# Altium schematic sheet USB_hub.SchDoc
size A4
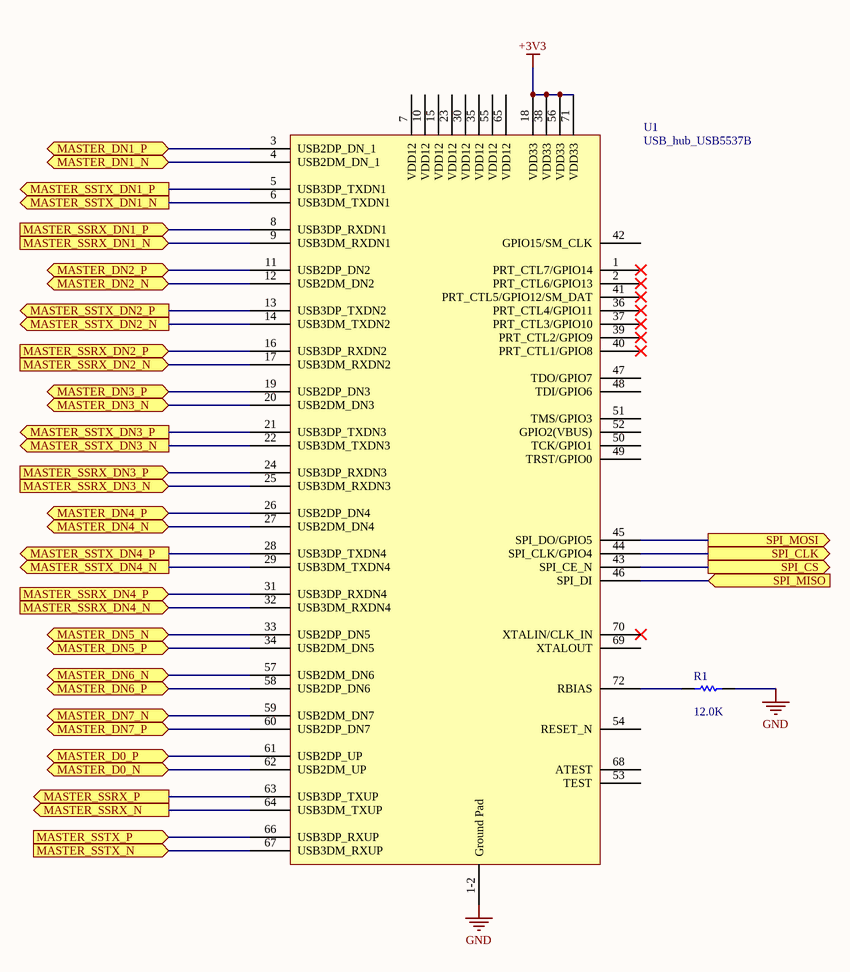
[diagram p0: USB_hub.SchDoc]

## Parts
R1  value 12.0K  [RESC6332]  (hidden comment: Res1)
U1  USB_hub_USB5537B  [QFN50P1000X1000X100_HS-73N]

## Ports
MASTER_D0_N (bidir), MASTER_D0_P (bidir), MASTER_DN1_N (bidir), MASTER_DN1_P (bidir), MASTER_DN2_N (bidir), MASTER_DN2_P (bidir), MASTER_DN3_N (bidir), MASTER_DN3_P (bidir), MASTER_DN4_N (bidir), MASTER_DN4_P (bidir), MASTER_DN5_N (bidir), MASTER_DN5_P (bidir), MASTER_DN6_N (bidir), MASTER_DN6_P (bidir), MASTER_DN7_N (bidir), MASTER_DN7_P (bidir), MASTER_SSRX_DN1_N (in), MASTER_SSRX_DN1_P (in), MASTER_SSRX_DN2_N (in), MASTER_SSRX_DN2_P (in), MASTER_SSRX_DN3_N (in), MASTER_SSRX_DN3_P (in), MASTER_SSRX_DN4_N (in), MASTER_SSRX_DN4_P (in), MASTER_SSRX_N (out), MASTER_SSRX_P (out), MASTER_SSTX_DN1_N (out), MASTER_SSTX_DN1_P (out), MASTER_SSTX_DN2_N (out), MASTER_SSTX_DN2_P (out), MASTER_SSTX_DN3_N (out), MASTER_SSTX_DN3_P (out), MASTER_SSTX_DN4_N (out), MASTER_SSTX_DN4_P (out), MASTER_SSTX_N (in), MASTER_SSTX_P (in), SPI_CLK (out), SPI_CS (out), SPI_MISO (in), SPI_MOSI (out)

## Nets
+3V3: U1.18(VDD33) U1.38(VDD33) U1.56(VDD33) U1.71(VDD33)
GND: R1.2 U1.1-2(Ground_Pad)
MASTER_D0_N: U1.62(USB2DM_UP) ; port MASTER_D0_N
MASTER_D0_P: U1.61(USB2DP_UP) ; port MASTER_D0_P
MASTER_DN1_N: U1.4(USB2DM_DN_1) ; port MASTER_DN1_N
MASTER_DN1_P: U1.3(USB2DP_DN_1) ; port MASTER_DN1_P
MASTER_DN2_N: U1.12(USB2DM_DN2) ; port MASTER_DN2_N
MASTER_DN2_P: U1.11(USB2DP_DN2) ; port MASTER_DN2_P
MASTER_DN3_N: U1.20(USB2DM_DN3) ; port MASTER_DN3_N
MASTER_DN3_P: U1.19(USB2DP_DN3) ; port MASTER_DN3_P
MASTER_DN4_N: U1.27(USB2DM_DN4) ; port MASTER_DN4_N
MASTER_DN4_P: U1.26(USB2DP_DN4) ; port MASTER_DN4_P
MASTER_DN5_N: U1.33(USB2DP_DN5) ; port MASTER_DN5_N
MASTER_DN5_P: U1.34(USB2DM_DN5) ; port MASTER_DN5_P
MASTER_DN6_N: U1.57(USB2DM_DN6) ; port MASTER_DN6_N
MASTER_DN6_P: U1.58(USB2DP_DN6) ; port MASTER_DN6_P
MASTER_DN7_N: U1.59(USB2DM_DN7) ; port MASTER_DN7_N
MASTER_DN7_P: U1.60(USB2DP_DN7) ; port MASTER_DN7_P
MASTER_SSRX_DN1_N: U1.9(USB3DM_RXDN1) ; port MASTER_SSRX_DN1_N
MASTER_SSRX_DN1_P: U1.8(USB3DP_RXDN1) ; port MASTER_SSRX_DN1_P
MASTER_SSRX_DN2_N: U1.17(USB3DM_RXDN2) ; port MASTER_SSRX_DN2_N
MASTER_SSRX_DN2_P: U1.16(USB3DP_RXDN2) ; port MASTER_SSRX_DN2_P
MASTER_SSRX_DN3_N: U1.25(USB3DM_RXDN3) ; port MASTER_SSRX_DN3_N
MASTER_SSRX_DN3_P: U1.24(USB3DP_RXDN3) ; port MASTER_SSRX_DN3_P
MASTER_SSRX_DN4_N: U1.32(USB3DM_RXDN4) ; port MASTER_SSRX_DN4_N
MASTER_SSRX_DN4_P: U1.31(USB3DP_RXDN4) ; port MASTER_SSRX_DN4_P
MASTER_SSRX_N: U1.64(USB3DM_TXUP) ; port MASTER_SSRX_N
MASTER_SSRX_P: U1.63(USB3DP_TXUP) ; port MASTER_SSRX_P
MASTER_SSTX_DN1_N: U1.6(USB3DM_TXDN1) ; port MASTER_SSTX_DN1_N
MASTER_SSTX_DN1_P: U1.5(USB3DP_TXDN1) ; port MASTER_SSTX_DN1_P
MASTER_SSTX_DN2_N: U1.14(USB3DM_TXDN2) ; port MASTER_SSTX_DN2_N
MASTER_SSTX_DN2_P: U1.13(USB3DP_TXDN2) ; port MASTER_SSTX_DN2_P
MASTER_SSTX_DN3_N: U1.22(USB3DM_TXDN3) ; port MASTER_SSTX_DN3_N
MASTER_SSTX_DN3_P: U1.21(USB3DP_TXDN3) ; port MASTER_SSTX_DN3_P
MASTER_SSTX_DN4_N: U1.29(USB3DM_TXDN4) ; port MASTER_SSTX_DN4_N
MASTER_SSTX_DN4_P: U1.28(USB3DP_TXDN4) ; port MASTER_SSTX_DN4_P
MASTER_SSTX_N: U1.67(USB3DM_RXUP) ; port MASTER_SSTX_N
MASTER_SSTX_P: U1.66(USB3DP_RXUP) ; port MASTER_SSTX_P
SPI_CLK: U1.44(SPI_CLK/GPIO4) ; port SPI_CLK
SPI_CS: U1.43(SPI_CE_N) ; port SPI_CS
SPI_MISO: U1.46(SPI_DI) ; port SPI_MISO
SPI_MOSI: U1.45(SPI_DO/GPIO5) ; port SPI_MOSI
NetR1_1: R1.1 U1.72(RBIAS)

Not connected (* = marked no-connect by the designer): U1 1(PRT_CTL7/GPIO14)* 2(PRT_CTL6/GPIO13)* 7(VDD12) 10(VDD12) 15(VDD12) 23(VDD12) 30(VDD12) 35(VDD12) 36(PRT_CTL4/GPIO11)* 37(PRT_CTL3/GPIO10)* 39(PRT_CTL2/GPIO9)* 40(PRT_CTL1/GPIO8)* 41(PRT_CTL5/GPIO12/SM_DAT)* 42(GPIO15/SM_CLK) 47(TDO/GPIO7) 48(TDI/GPIO6) 49(TRST/GPIO0) 50(TCK/GPIO1) 51(TMS/GPIO3) 52(GPIO2(VBUS)) 53(TEST) 54(RESET_N) 55(VDD12) 65(VDD12) 68(ATEST) 69(XTALOUT) 70(XTALIN/CLK_IN)*

## Library data of the parts
R1 = Res1: Resistor; Published: 8-Jun-2000; LatestRevisionDate: 17-Jul-2002; LatestRevisionNote: Re-released for DXP Platform.; PackageReference: AXIAL-0.3; Publisher: Altium Limited; PackageDescription: Axial Device, Thru-Hole; 2 Leads; 0.3 in Pin Spacing
U1 = USB_hub_USB5537B: https://media.digikey.com/pdf/Data%20Sheets/Microchip%20PDFs/USB5537B.pdf